# Altium schematic sheet BMS.SchDoc
size 297 x 209 mm
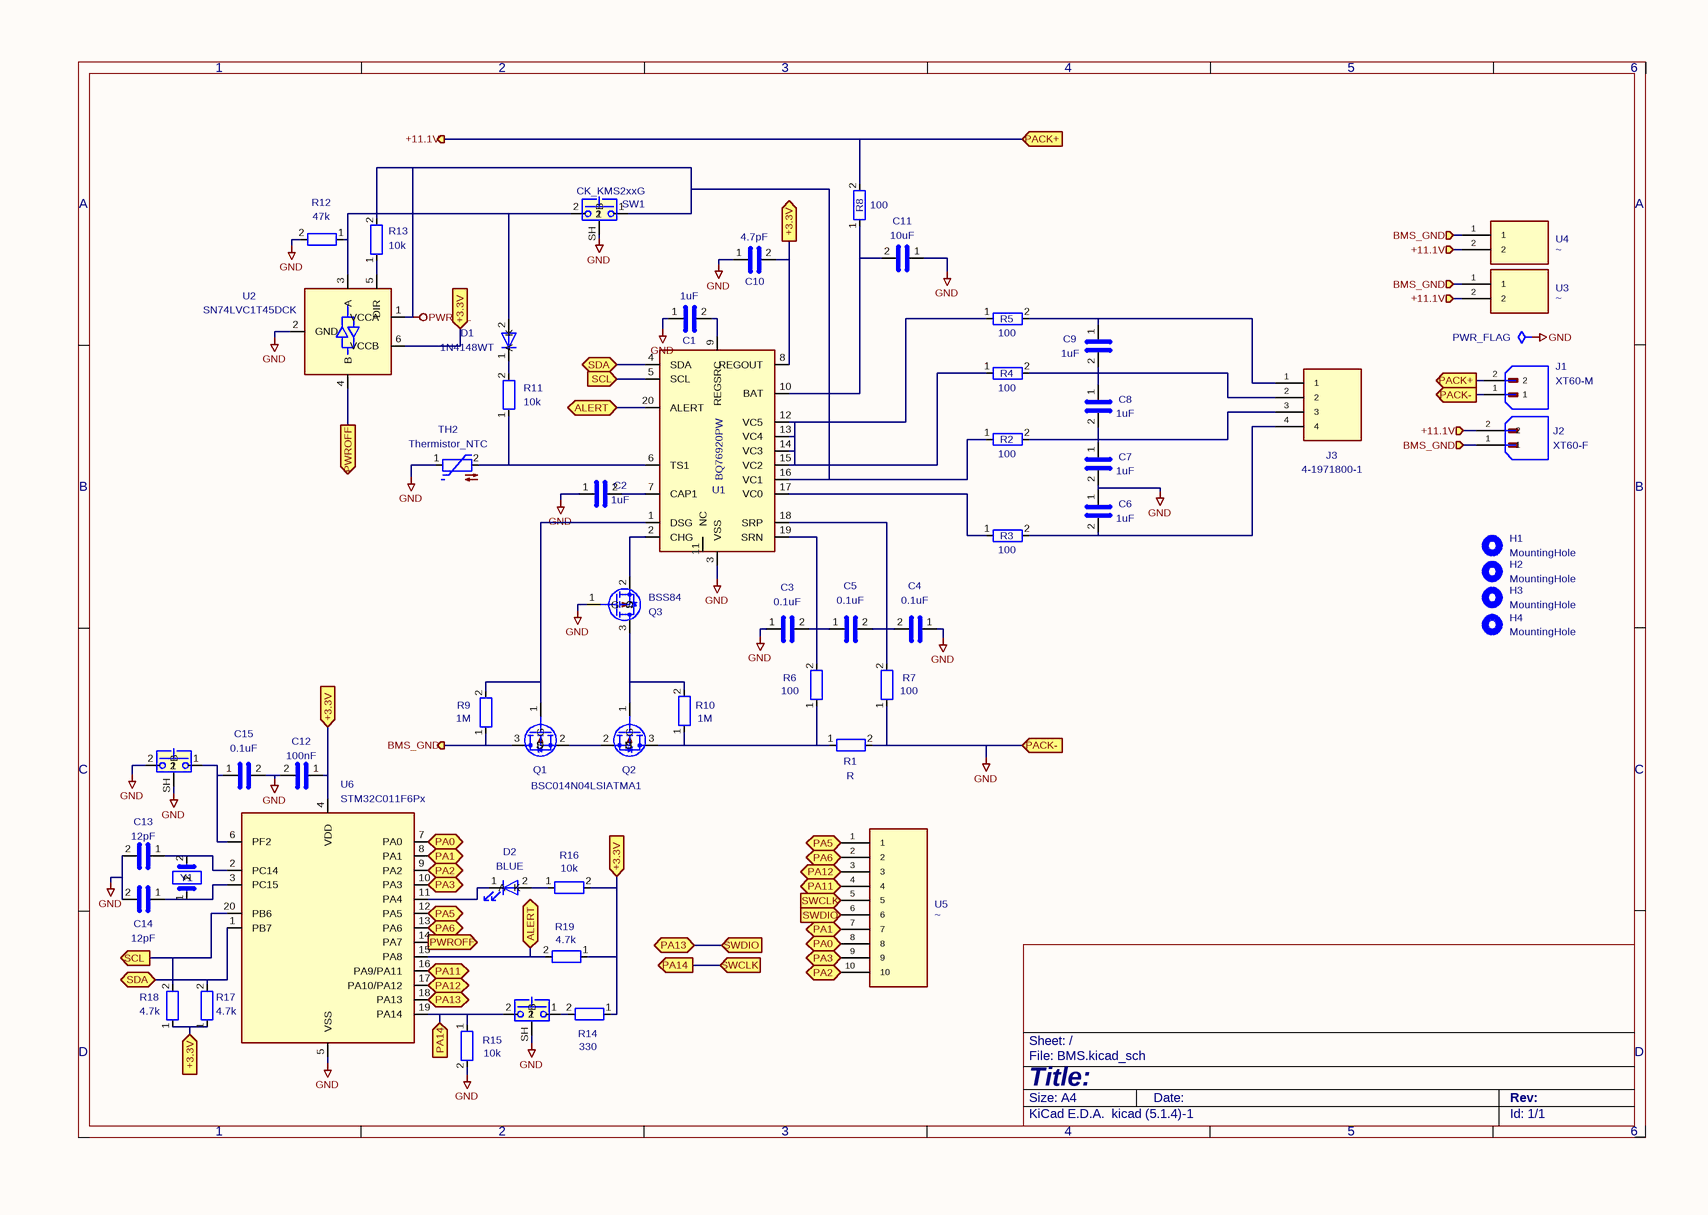
[diagram p0: BMS.SchDoc]

## Parts
#FLG02  PWR_FLAG  (graphical)
C1  1uF  [C_0603_1608Metric_Pad1.08x0.95mm_HandSolder]
C2  1uF  [C_0603_1608Metric_Pad1.08x0.95mm_HandSolder]
C3  0.1uF  [C_0603_1608Metric_Pad1.08x0.95mm_HandSolder]
C4  0.1uF  [C_0603_1608Metric_Pad1.08x0.95mm_HandSolder]
C5  0.1uF  [C_0603_1608Metric_Pad1.08x0.95mm_HandSolder]
C6  1uF  [C_0805_2012Metric_Pad1.18x1.45mm_HandSolder]
C7  1uF  [C_0805_2012Metric_Pad1.18x1.45mm_HandSolder]
C8  1uF  [C_0805_2012Metric_Pad1.18x1.45mm_HandSolder]
C9  1uF  [C_0805_2012Metric_Pad1.18x1.45mm_HandSolder]
C10  4.7pF  [C_0402_1005Metric_Pad0.74x0.62mm_HandSolder]
C11  10uF  [C_1210_3225Metric_Pad1.33x2.70mm_HandSolder]
C12  100nF  [C_0402_1005Metric_Pad0.74x0.62mm_HandSolder]
C13  12pF  [C_0603_1608Metric_Pad1.08x0.95mm_HandSolder]
C14  12pF  [C_0603_1608Metric_Pad1.08x0.95mm_HandSolder]
C15  0.1uF  [C_0402_1005Metric_Pad0.74x0.62mm_HandSolder]
D1  1N4148WT  [D_SOD-523]
D2  BLUE  [D_0603_1608Metric_Pad1.05x0.95mm_HandSolder]
H1  MountingHole  [MountingHole_3.2mm_M3_DIN965]
H2  MountingHole  [MountingHole_3.2mm_M3_DIN965]
H3  MountingHole  [MountingHole_3.2mm_M3_DIN965]
H4  MountingHole  [MountingHole_3.2mm_M3_DIN965]
J1  XT60-M  [AMASS_XT60PW-M_1x02_P7.20mm_Horizontal]
J2  XT60-F  [AMASS_XT60PW-F_1x02_P7.20mm_Horizontal]
J3  4-1971800-1  [JST_XH_S4B-XH-A_1x04_P2.50mm_Horizontal]
Q1  BSC014N04LSIATMA1  [TRANS_BSC014N04LSIATMA1]
Q2  BSC014N04LSIATMA1  [TRANS_BSC014N04LSIATMA1]  (value not drawn)
Q3  BSS84  [SOT-23]
R1  R  [R_3920]
R2  100  [R_0402_1005Metric_Pad0.72x0.64mm_HandSolder]
R3  100  [R_0402_1005Metric_Pad0.72x0.64mm_HandSolder]
R4  100  [R_0402_1005Metric_Pad0.72x0.64mm_HandSolder]
R5  100  [R_0402_1005Metric_Pad0.72x0.64mm_HandSolder]
R6  100  [R_0402_1005Metric_Pad0.72x0.64mm_HandSolder]
R7  100  [R_0402_1005Metric_Pad0.72x0.64mm_HandSolder]
R8  100  [R_0402_1005Metric_Pad0.72x0.64mm_HandSolder]
R9  1M  [R_0603_1608Metric_Pad0.98x0.95mm_HandSolder]
R10  1M  [R_0603_1608Metric_Pad0.98x0.95mm_HandSolder]
R11  10k  [R_0603_1608Metric_Pad0.98x0.95mm_HandSolder]
R12  47k  [R_0603_1608Metric_Pad0.98x0.95mm_HandSolder]
R13  10k  [R_0603_1608Metric_Pad0.98x0.95mm_HandSolder]
R14  330  [R_0402_1005Metric_Pad0.72x0.64mm_HandSolder]
R15  10k  [R_0402_1005Metric_Pad0.72x0.64mm_HandSolder]
R16  10k  [R_0402_1005Metric_Pad0.72x0.64mm_HandSolder]
R17  4.7k  [R_0603_1608Metric_Pad0.98x0.95mm_HandSolder]
R18  4.7k  [R_0603_1608Metric_Pad0.98x0.95mm_HandSolder]
R19  4.7k  [R_0603_1608Metric_Pad0.98x0.95mm_HandSolder]
SW1  CK_KMS2xxG  [SW_SPST_CK_KMS2xxG]
SW2  CK_KMS2xxG  [SW_SPST_CK_KMS2xxG]  (value not drawn)
SW3  CK_KMS2xxG  [SW_SPST_CK_KMS2xxG]  (value not drawn)
TH2  Thermistor_NTC  [R_0603_1608Metric_Pad0.98x0.95mm_HandSolder]
U1  BQ76920PW  [TSSOP-20_4.4x6.5mm_P0.65mm]
U2  SN74LVC1T45DCK  [SOT-23-6_Handsoldering]
U3  ~  [JST_GH_SM02B-GHS-TB_1x02-1MP_P1.25mm_Horizontal]
U4  ~  [JST_GH_SM02B-GHS-TB_1x02-1MP_P1.25mm_Horizontal]
U5  ~  [PinHeader_2x05_P2.54mm_Horizontal]
U6  STM32C011F6Px  [TSSOP-20_4.4x6.5mm_P0.65mm]
Y1  Crystal  [NX3215SA-32.768K-STD-MUA-8]  (value not drawn)

## Ports
+3.3V (in), +3.3V (out), +11.1V (in), +11.1V (out), ALERT (bidir), BMS_GND (in), BMS_GND (out), PA0 (bidir), PA1 (bidir), PA2 (bidir), PA3 (bidir), PA5 (bidir), PA6 (bidir), PA11 (bidir), PA12 (bidir), PA13 (bidir), PA14 (in), PA14 (out), PACK+ (in), PACK+ (out), PACK- (in), PACK- (out), PWROFF (in), PWROFF (out), SCL (in), SCL (out), SDA (bidir), SWCLK (in), SWCLK (out), SWDIO (in), SWDIO (out)

## Nets
GND: #FLG02.1 C1.1 C2.1 C3.1 C4.1 C6.1 C7.2 C10.1 C11.1 C12.2 C13.2 C14.2 C15.2 J1.1 Q3.1(G) R1.2 R7.1 R12.2 R15.2 SW1.SH(B) SW2.2 SW2.SH(B) SW3.SH(B) TH2.1 U1.3(VSS) U2.2(GND) U6.5(VSS) ; port PACK-
PWR_FL: R2.1 R13.2 SW1.1 U1.16(VC1) U2.1(VCCA)
+3.3V: C10.2 C12.1 R14.1 R16.2 R17.1 R18.1 R19.1 U1.8(REGOUT) U2.6(VCCB) U6.4(VDD) ; port +3.3V
+11.1V: J1.2 J2.2 R8.2 U3.2 U4.2 ; port PACK+, port +11.1V
ALERT: R19.2 U1.20(ALERT) U6.15(PA8) ; port ALERT
BMS_GND: J2.1 Q1.3(D) R9.1 U3.1 U4.1 ; port BMS_GND
PA0: U5.8 U6.7(PA0) ; port PA0
PA1: U5.7 U6.8(PA1) ; port PA1
PA2: U5.10 U6.9(PA2) ; port PA2
PA3: U5.9 U6.10(PA3) ; port PA3
PA5: U5.1 U6.12(PA5) ; port PA5
PA6: U5.2 U6.13(PA6) ; port PA6
PA11: U5.4 U6.16(PA9/PA11) ; port PA11
PA12: U5.3 U6.17(PA10/PA12) ; port PA12
PA13: U5.6 U6.18(PA13) ; port SWDIO, port PA13
PA14: R15.1 SW3.2 U5.5 U6.19(PA14) ; port SWCLK, port PA14
PWROFF: U2.4(B) U6.14(PA7) ; port PWROFF
SCL: R18.2 U1.5(SCL) U6.20(PB6) ; port SCL
SDA: R17.2 U1.4(SDA) U6.1(PB7) ; port SDA
NetC1_2: C1.2 U1.9(REGSRC)
NetC2_2: C2.2 U1.7(CAP1)
NetC3_2: C3.2 C5.1 R6.2 U1.19(SRN)
NetC4_2: C4.2 C5.2 R7.2 U1.18(SRP)
NetC6_2: C6.2 J3.4 R3.2
NetC7_1: C7.1 C8.2 J3.3 R2.2
NetC8_1: C8.1 C9.2 J3.2 R4.2
NetC9_1: C9.1 J3.1 R5.2
NetC11_2: C11.2 R8.1 U1.10(BAT)
NetC13_1: C13.1 U6.2(PC14) Y1.2
NetC14_1: C14.1 U6.3(PC15) Y1.1
NetC15_1: C15.1 SW2.1 U6.6(PF2)
NetD1_1: D1.1(K) R11.2
NetD1_2: D1.2(A) R12.1 SW1.2 U2.3(A)
NetD2_1: D2.1(K) U6.11(PA4)
NetD2_2: D2.2(A) R16.1
NetQ1_1: Q1.1(G) R9.2 U1.1(DSG)
NetQ1_2: Q1.2(S) Q2.2(S)
NetQ2_1: Q2.1(G) Q3.3(D) R10.2
NetQ2_3: Q2.3(D) R1.1 R6.1 R10.1
NetQ3_2: Q3.2(S) U1.2(CHG)
NetR3_1: R3.1 U1.17(VC0)
NetR4_1: R4.1 R5.1 U1.12(VC5) U1.13(VC4) U1.14(VC3) U1.15(VC2)
NetR11_1: R11.1 TH2.2 U1.6(TS1)
NetR13_1: R13.1 U2.5(DIR)
NetR14_2: R14.2 SW3.1

Not connected (* = marked no-connect by the designer): U1 11(NC)

## Notes on the sheet
- 1
- 2
- 3
- 4
- 5
- 6
- A
- B
- C
- D
- Title:
- File: BMS.kicad_sch
- Sheet: /
- KiCad E.D.A.  kicad (5.1.4)-1
- Size: A4
- Date:
- Rev:
- Id: 1/1

## Library data of the parts
#FLG02 = PWR_FLAG: Description: Special symbol for telling ERC where power comes from; Value: PWR_FLAG
C1-C15 = C: Description: Unpolarized capacitor
  C1 C2: Website: https://eu.mouser.com/ProductDetail/TDK/C1608X7R1H105K080AB?qs=efUn273yAhdzCWVW9RXgig%3D%3D; Value: 1uF; Footprint: Capacitor_SMD:C_0603_1608Metric_Pad1.08x0.95mm_HandSolder
  C3-C5: Website: https://eu.mouser.com/ProductDetail/Murata-Electronics/GCM188R71H104JA57D?qs=ui%252B2d9lVEI4ebGBmb9XKtA%3D%3D; Value: 0.1uF; Footprint: Capacitor_SMD:C_0603_1608Metric_Pad1.08x0.95mm_HandSolder
  C6-C9: Website: http://eu.mouser.com/ProductDetail/Murata-Electronics/GCJ21BR71H105MA01K?qs=QzBtWTOodeVZ%252BTk8SNChEw%3D%3D; Value: 1uF; Footprint: Capacitor_SMD:C_0805_2012Metric_Pad1.18x1.45mm_HandSolder
  C10: Website: https://eu.mouser.com/ProductDetail/Murata-Electronics/GCQ1555C1H4R7WB01D?qs=0lQeLiL1qyYRZt16ZY6xZA%3D%3D; Value: 4.7pF; Footprint: Capacitor_SMD:C_0402_1005Metric_Pad0.74x0.62mm_HandSolder
  C11: Website: https://www.mouser.bg/ProductDetail/Murata-Electronics/GRM32ER71J106KA12L?qs=eeBpzGFlv%252B%2FlkjOiPI7fBw%3D%3D; Value: 10uF; Footprint: Capacitor_SMD:C_1210_3225Metric_Pad1.33x2.70mm_HandSolder
  C12: Website: https://eu.mouser.com/ProductDetail/Murata-Electronics/GCM188R71H104JA57D?qs=ui%252B2d9lVEI4ebGBmb9XKtA%3D%3D; Value: 100nF; Footprint: Capacitor_SMD:C_0402_1005Metric_Pad0.74x0.62mm_HandSolder
  C13 C14: Website: https://eu.mouser.com/ProductDetail/Murata-Electronics/GCM188R71H104JA57D?qs=ui%252B2d9lVEI4ebGBmb9XKtA%3D%3D; Value: 12pF; Footprint: Capacitor_SMD:C_0603_1608Metric_Pad1.08x0.95mm_HandSolder
  C15: Website: https://eu.mouser.com/ProductDetail/Murata-Electronics/GCM188R71H104JA57D?qs=ui%252B2d9lVEI4ebGBmb9XKtA%3D%3D; Value: 0.1uF; Footprint: Capacitor_SMD:C_0402_1005Metric_Pad0.74x0.62mm_HandSolder
D1 = 1N4148WT: Description: 75V 0.15A Fast switching Diode, SOD-523; Sim.Device: D; Sim.Pins: 1=K 2=A; Value: 1N4148WT; Footprint: Diode_SMD:D_SOD-523
D2 = LED: Description: Light emitting diode; Value: BLUE; Footprint: Diode_SMD:D_0603_1608Metric_Pad1.05x0.95mm_HandSolder
H1-H4 = MountingHole: Description: Mounting Hole without connection; Value: MountingHole; Footprint: MountingHole:MountingHole_3.2mm_M3_DIN965
J1 = XT60-M: MF: AMASS; Description_1: \n                        \n                            Plug; DC supply; XT60; male; PIN: 2; for cable; soldered; 30A; 500V\n                        \n; MAXIMUM_PACKAGE_HEIGHT: 16.00 mm; Package: Package; Price: None; Check_prices: https://www.snapeda.com/parts/XT60-M/AMASS/view-part/?ref=eda; STANDARD: IPC 7351B; PARTREV: V1.2; SnapEDA_Link: https://www.snapeda.com/parts/XT60-M/AMASS/view-part/?ref=snap; MP: XT60-M; Availability: Not in stock; MANUFACTURER: AMASS; Value: XT60-M; Footprint: Connector_AMASS:AMASS_XT60PW-M_1x02_P7.20mm_Horizontal
J2 = XT60-M_1: MF: AMASS; MP: XT60-M; Description_1: \n                        \n                            Plug; DC supply; XT60; male; PIN: 2; for cable; soldered; 30A; 500V\n                        \n; MAXIMUM_PACKAGE_HEIGHT: 16.00 mm; Package: Package; Price: None; Check_prices: https://www.snapeda.com/parts/XT60-M/AMASS/view-part/?ref=eda; STANDARD: IPC 7351B; PARTREV: V1.2; SnapEDA_Link: https://www.snapeda.com/parts/XT60-M/AMASS/view-part/?ref=snap; Availability: Not in stock; MANUFACTURER: AMASS; Value: XT60-F; Footprint: Connector_AMASS:AMASS_XT60PW-F_1x02_P7.20mm_Horizontal
J3 = 4-1971800-1: Description: New Gi Conn2.5 Hdr Asmbly 3p Red D1.5, 3-1971800-3; MF: TE Connectivity; Description_1: \n                        \n                            Connector Header Through Hole 4 position 0.098 (2.50mm)\n                        \n; Check_prices: https://www.snapeda.com/parts/4-1971800-1/TE+Connectivity/view-part/?ref=eda; PACKAGE: None; PRICE: None; Package: None; TE_PURCHASE_URL: https://www.te.com/usa-en/product-3-1971800-3.html?te_bu=Cor&te_type=disp&te_campaign=seda_glo_cor-seda-global-disp-prtnr-fy19-seda-model-bom-cta_sma-317_1&elqCampaignId=32493; Price: None; SnapEDA_Link: https://www.snapeda.com/parts/4-1971800-1/TE+Connectivity/view-part/?ref=snap; MP: 4-1971800-1; EU_ROHS_COMPLIANCE: Compliant; Availability: In Stock; AVAILABILITY: Unavailable; Value: 4-1971800-1; Footprint: Connector_JST:JST_XH_S4B-XH-A_1x04_P2.50mm_Horizontal
Q1 Q2 = 2N7002E: Value: BSC014N04LSIATMA1; Footprint: MOSFET-N:TRANS_BSC014N04LSIATMA1
Q3 = BSS84: Description: -0.13A Id, -50V Vds, P-Channel MOSFET, SOT-23; Website: https://eu.mouser.com/ProductDetail/onsemi-Fairchild/BSS84?qs=FOlmdCx%252BAA0e83h5MpSc0g%3D%3D; Value: BSS84; Footprint: Package_TO_SOT_SMD:SOT-23
R1-R19 = R: Description: Resistor
  R1: Value: R; Footprint: Resistor:R_3920
  R2-R8: Website: https://store.comet.bg/Catalogue/Product/36541/; Value: 100; Footprint: Resistor_SMD:R_0402_1005Metric_Pad0.72x0.64mm_HandSolder
  R9 R10: Website: https://store.comet.bg/Catalogue/Product/4430/; Value: 1M; Footprint: Resistor_SMD:R_0603_1608Metric_Pad0.98x0.95mm_HandSolder
  R11 R13: Value: 10k; Footprint: Resistor_SMD:R_0603_1608Metric_Pad0.98x0.95mm_HandSolder
  R12: Value: 47k; Footprint: Resistor_SMD:R_0603_1608Metric_Pad0.98x0.95mm_HandSolder
  R14: Website: https://store.comet.bg/Catalogue/Product/36541/; Value: 330; Footprint: Resistor_SMD:R_0402_1005Metric_Pad0.72x0.64mm_HandSolder
  R15 R16: Website: https://store.comet.bg/Catalogue/Product/36541/; Value: 10k; Footprint: Resistor_SMD:R_0402_1005Metric_Pad0.72x0.64mm_HandSolder
  R17-R19: Value: 4.7k; Footprint: Resistor_SMD:R_0603_1608Metric_Pad0.98x0.95mm_HandSolder
SW1-SW3 = CK_KMS2xxG: Description: Microminiature SMT Side Actuated, 4.2 x 2.8 x 1.42mm, without pegs, with shield pin; Value: CK_KMS2xxG; Footprint: Button_Switch_SMD:SW_SPST_CK_KMS2xxG
TH2 = Thermistor_NTC: Description: Temperature dependent resistor, negative temperature coefficient; Value: Thermistor_NTC; Footprint: Resistor_SMD:R_0603_1608Metric_Pad0.98x0.95mm_HandSolder
U1 = BQ76920PW: Description: Lithium battery monitor, 3-5 cells, integrated balancing, I2C interface, TSSOP-20; Website: https://www.mouser.bg/ProductDetail/Murata-Electronics/NCP18XH103F03RB?qs=k3rQb2PKXqkF9YvF09qsvw%3D%3D; Value: BQ76920PW; Footprint: Package_SO:TSSOP-20_4.4x6.5mm_P0.65mm
U2 = SN74LVC1T45DCK: Description: Single-Bit Dual-Supply Bus Transceiver With Configurable Voltage Translation and 3-State Outputs, SOT-363; Value: SN74LVC1T45DCK; Footprint: Package_TO_SOT_SMD:SOT-23-6_Handsoldering
U3 U4 = H_2: Value: ~; Footprint: Connector_JST:JST_GH_SM02B-GHS-TB_1x02-1MP_P1.25mm_Horizontal
U5 = H_10: Value: ~; Footprint: Connector_PinHeader_2.54mm:PinHeader_2x05_P2.54mm_Horizontal
U6 = STM32C011F6Px: Description: STMicroelectronics Arm Cortex-M0+ MCU, 32KB flash, 6KB RAM, 48 MHz, 2.0-3.6V, 18 GPIO, TSSOP20; Value: STM32C011F6Px; Footprint: Package_SO:TSSOP-20_4.4x6.5mm_P0.65mm
Y1 = Crystal: Description: Two pin crystal; Value: Crystal; Footprint: Crystals:NX3215SA-32.768K-STD-MUA-8